# Altium schematic sheet OSSI-1 Front Panel.SchDoc: TITLE:
size 410 x 286 mm; Date: Date:; >LAST_DATE_TIME: 01/11/2015 13:32:05; Sheet:: Sheet:; >SHEET: 1; REV:: REV:; Document Number:: Document Number:; >DRAWING_NAME: OSSI-1 Front Panel.sch
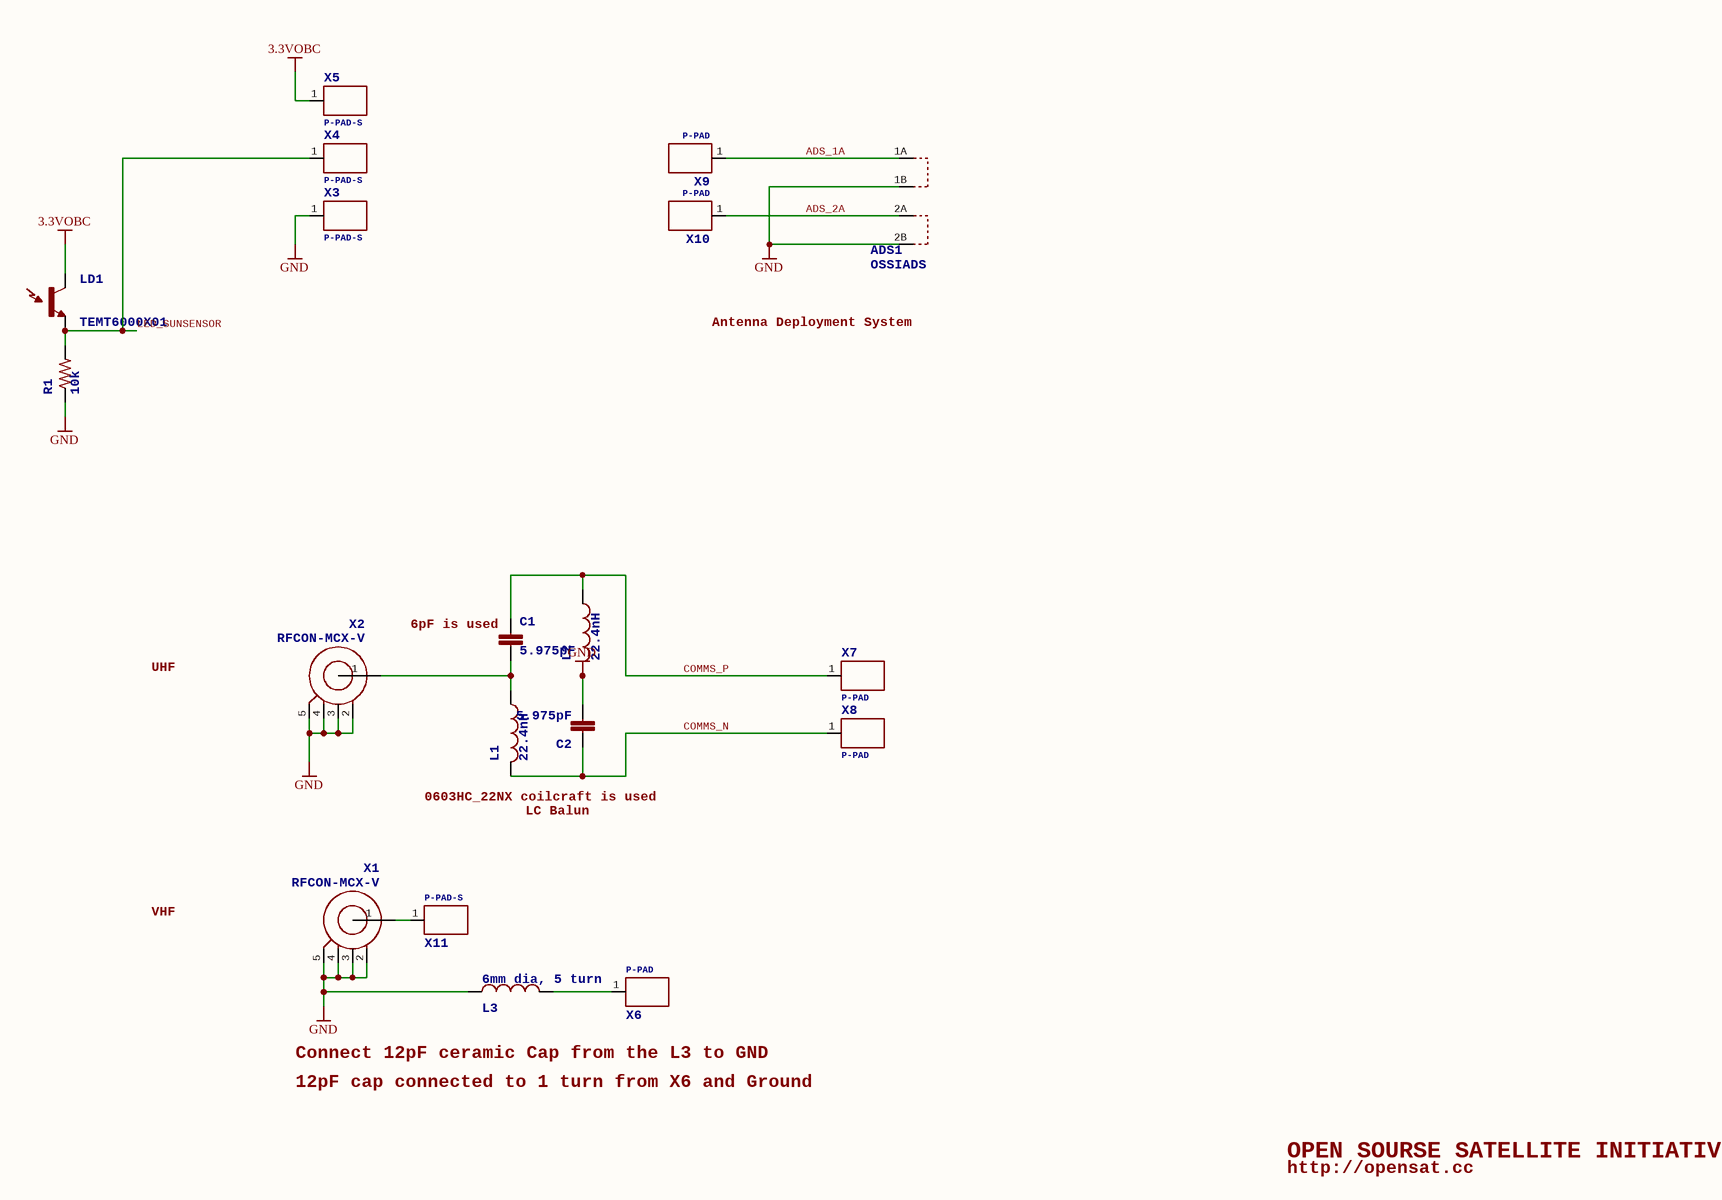
[diagram p0: OSSI-1 Front Panel.SchDoc]

## Parts
ADS1  >NAME: ADS1  [OSSIADS]  (hidden comment: OSSIADS)
C1  >NAME: C1  [C0805(2012)]  (hidden comment: 5.975pF)
C2  >NAME: C2  [C0805(2012)]  (hidden comment: 5.975pF)
L1  >NAME: L1  [L0805(2012)]  (hidden comment: 22.4nH)
L2  >NAME: L2  [L0805(2012)]  (hidden comment: 22.4nH)
L3  >NAME: L3  [0207/10]  (hidden comment: 6mm dia, 5 turn)
LD1  >NAME: LD1  [TEMT6000-SEN]  (hidden comment: TEMT6000X01)
R1  >NAME: R1  [R0805(2012)]  (hidden comment: 10k)
X1  >NAME: X1  [MCX-V]  (hidden comment: RFCON-MCX-V)
X2  >NAME: X2  [MCX-V]  (hidden comment: RFCON-MCX-V)
X3  >NAME: X3  [P-PAD-S]  (hidden comment: P-PAD-S)
X4  >NAME: X4  [P-PAD-S]  (hidden comment: P-PAD-S)
X5  >NAME: X5  [P-PAD-S]  (hidden comment: P-PAD-S)
X6  >NAME: X6  [P-PAD]  (hidden comment: P-PAD)
X7  >NAME: X7  [P-PAD]  (hidden comment: P-PAD)
X8  >NAME: X8  [P-PAD]  (hidden comment: P-PAD)
X9  >NAME: X9  [P-PAD]  (hidden comment: P-PAD)
X10  >NAME: X10  [P-PAD]  (hidden comment: P-PAD)
X11  >NAME: X11  [P-PAD-S]  (hidden comment: P-PAD-S)

## Nets
3.3VOBC: LD1.COLLECTOR(C1) X5.1(P$1)
GND: ADS1.1B ADS1.2B C2.2 L2.2 L3.2 R1.1 X1.2 X1.3 X1.4 X1.5 X2.2 X2.3 X2.4 X2.5 X3.1(P$1)
ADS_1A: ADS1.1A X9.1(P$1)
ADS_2A: ADS1.2A X10.1(P$1)
COMMS_N: C2.1 L1.2 X8.1(P$1)
COMMS_P: C1.1 L2.1 X7.1(P$1)
LED_SUNSENSOR: LD1.EMITTER(E1) R1.2 X4.1(P$1)
NetC1_2: C1.2 L1.1 X2.1
NetL3_1: L3.1 X6.1(P$1)
NetX1_1: X1.1 X11.1(P$1)

## Notes on the sheet
- Antenna Deployment System
- UHF
- (near C1) 6pF is used
- (near L1) 0603HC_22NX coilcraft is used
- LC Balun
- VHF
- Connect 12pF ceramic Cap from the L3 to GND
- 12pF cap connected to 1 turn from X6 and Ground
- OPEN SOURSE SATELLITE INITIATIVE
- http://opensat.cc

## Library data of the parts
C1 C2 = C0805(2012): >VALUE: 5.975pF
L1 L2 = L0805(2012): >VALUE: 22.4nH
L3 = L-US0207/10: <B>INDUCTOR</B>, American symbol; >VALUE: 6mm dia, 5 turn
LD1 = TEMT6000X01: <b>Ambient Light Sensor</b> / Simple light detection sensor. Output varies with light intensity input. Spark Fun Electronics SKU : COM-08348; >VALUE: TEMT6000X01
R1 = R0805(2012): >VALUE: 10k
X1 X2 = RFCON-MCX-V: RF Connectors; >VALUE: RFCON-MCX-V
ADS1 = OSSIADS: >VALUE: OSSIADS
X3-X5 X11 = P-PAD-S: >VALUE: P-PAD-S
X6-X10 = P-PAD: >VALUE: P-PAD